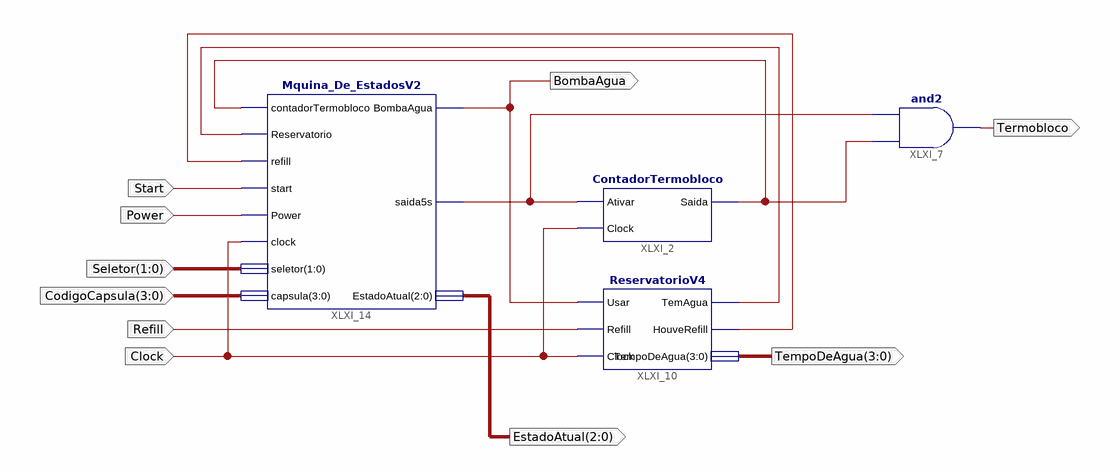
[diagram p0: schematic sheet 1]
// Xilinx ISE schematic Maquina_de_cafe.sch (spartan6) as structural Verilog: 4 symbols, 10 ports
module Maquina_de_cafe (
  input  [1:0] Seletor,
  input  Clock,
  input  Power,
  input  Start,
  input  Refill,
  input  [3:0] CodigoCapsula,
  output BombaAgua,
  output [3:0] TempoDeAgua,
  output [2:0] EstadoAtual,
  output Termobloco
);

  wire testeRefill, XLXN_3, XLXN_4, XLXN_16;

  ContadorTermobloco XLXI_2 (.Ativar(XLXN_16), .Clock(Clock), .Saida(XLXN_3));
  ReservatorioV4 XLXI_10 (
    .Usar(BombaAgua), .Refill(Refill), .Clock(Clock), .TemAgua(XLXN_4), .HouveRefill(testeRefill),
    .TempoDeAgua(TempoDeAgua));
  and XLXI_7 (Termobloco, XLXN_3, XLXN_16);
  Mquina_De_EstadosV2 XLXI_14 (
    .contadorTermobloco(XLXN_3), .Reservatorio(XLXN_4), .refill(testeRefill), .start(Start), .Power(Power),
    .clock(Clock), .seletor(Seletor), .capsula(CodigoCapsula), .BombaAgua(BombaAgua), .saida5s(XLXN_16),
    .EstadoAtual(EstadoAtual));
endmodule
